# Altium schematic sheet MAIN.SchDoc
size A4
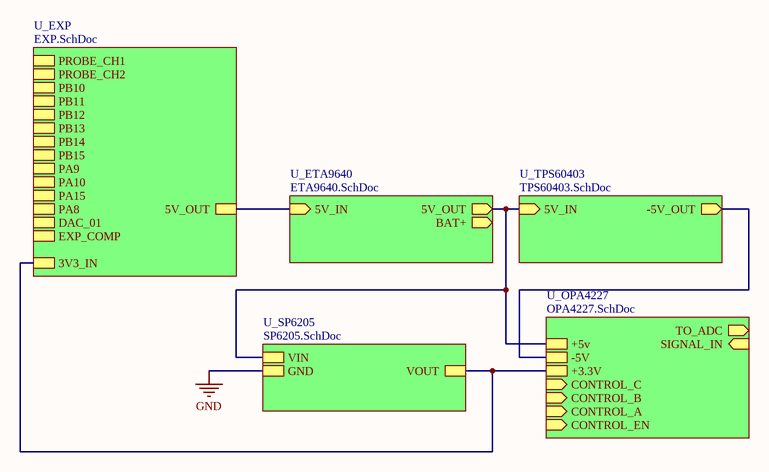
[diagram p0: MAIN.SchDoc]

## Sub-sheets
U_ETA9640 = ETA9640.SchDoc: 5V_IN (in), 5V_OUT (out), BAT+ (out)
U_EXP = EXP.SchDoc: PROBE_CH1, PROBE_CH2, PB10, PB11, PB12, PB13, PB14, PB15, PA9, PA10, PA15, PA8, DAC_01, EXP_COMP, 5V_OUT, 3V3_IN
U_OPA4227 = OPA4227.SchDoc: SIGNAL_IN (in), TO_ADC (out), +5v, -5V, +3.3V, CONTROL_C (in), CONTROL_B (in), CONTROL_A (in), CONTROL_EN (in)
U_SP6205 = SP6205.SchDoc: VIN, GND, VOUT
U_TPS60403 = TPS60403.SchDoc: 5V_IN (in), -5V_OUT (out)

## Nets
GND: sheet U_SP6205/GND
(unnamed): sheet U_EXP/5V_OUT, sheet U_ETA9640/5V_IN
(unnamed): sheet U_EXP/3V3_IN, sheet U_OPA4227/+3.3V, sheet U_SP6205/VOUT
(unnamed): sheet U_TPS60403/5V_IN, sheet U_OPA4227/+5v, sheet U_ETA9640/5V_OUT, sheet U_SP6205/VIN
(unnamed): sheet U_TPS60403/-5V_OUT, sheet U_OPA4227/-5V